# EAGLE design 2PCB-Part2 (EAGLE 9.6.2)
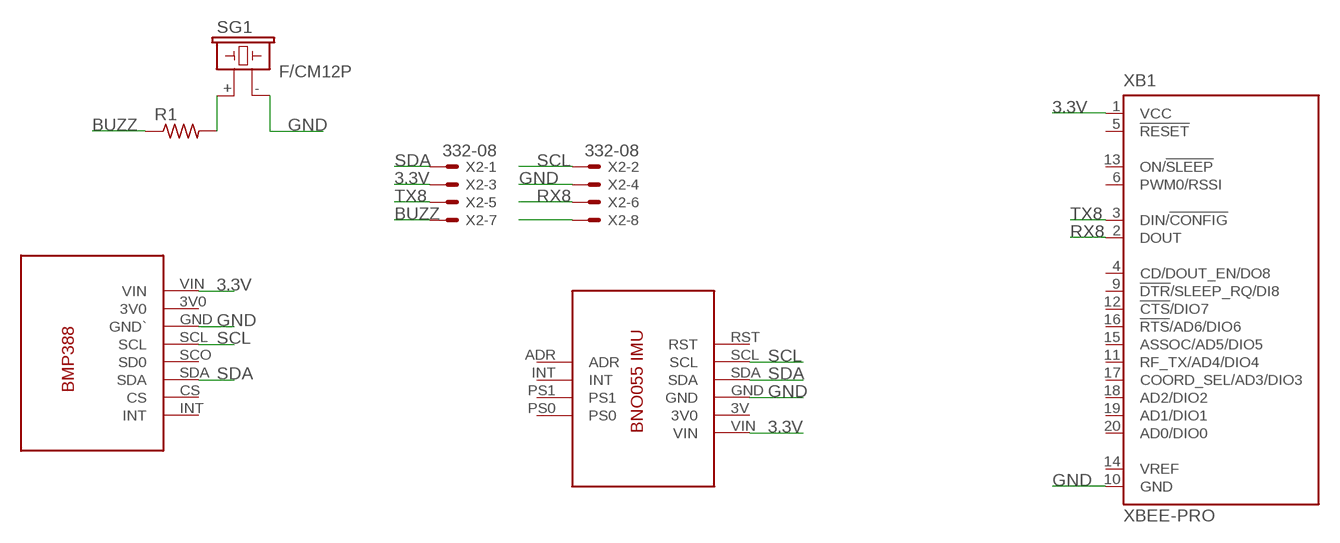
[diagram p0: schematic, sheet 1]

## Parts
R1  R-US_0207/10  [0207/10]
SG1  F/CM12P  [F/CM12P]
U$1  BNO055  [BNO055]
U$2  BMP388  [BMP388]
X2  332-08  [332-08]
XB1  XBEE-PRO  [XBEE-PRO]

## Nets
3.3V: U$1.VIN U$2.VIN X2.3 XB1.1(VCC)
BUZZ: R1.1 X2.7
GND: SG1.- U$1.GND U$2.GND(GND`) X2.4 XB1.10(GND)
N$4: R1.2 SG1.+
N$9: X2.8
RX8: X2.6 XB1.2(DOUT)
SCL: U$1.SCL U$2.SCL X2.2
SDA: U$1.SDA U$2.SDA X2.1
TX8: X2.5 XB1.3(DIN/!CONFIG)
Unconnected: U$1.3V(3V0) U$1.ADR U$1.INT U$1.PS0 U$1.PS1 U$1.RST U$2.3V0 U$2.CS U$2.INT U$2.SCO(SD0) XB1.4(CD/DOUT_EN/DO8) XB1.5(!RESET) XB1.6(PWM0/RSSI) XB1.9(!DTR!/SLEEP_RQ/DI8) XB1.11(RF_TX/AD4/DIO4) XB1.12(!CTS!/DIO7) XB1.13(ON/!SLEEP) XB1.14(VREF) XB1.15(ASSOC/AD5/DIO5) XB1.16(!RTS!/AD6/DIO6) XB1.17(COORD_SEL/AD3/DIO3) XB1.18(AD2/DIO2) XB1.19(AD1/DIO1) XB1.20(AD0/DIO0)

## Library data of the parts
R1 = rcl:R-US_: RESISTOR, American symbol; SPICEPREFIX: R
SG1 = buzzer:F/CM12P: BUZZER Source: Buerklin; OC_FARNELL: unknown; OC_NEWARK: unknown
U$1 = Bno055:BNO055
U$2 = bmp388:BMP388
X2 = 6pinConnector:332-08: 8 Pin - 2mm Dual Row Source: www.mpe-connector.de / garry_shortform_2012.pdf
XB1 = maxstream:XBEE: XBee (TM) /XBee-PRO(TM) OEM RF Modules Source: MaxStream, Inc. xbee_productmanual.pdf; MPN: XBP24-AWI-001; OC_FARNELL: 1337916; OC_NEWARK: 42M2667

## Board
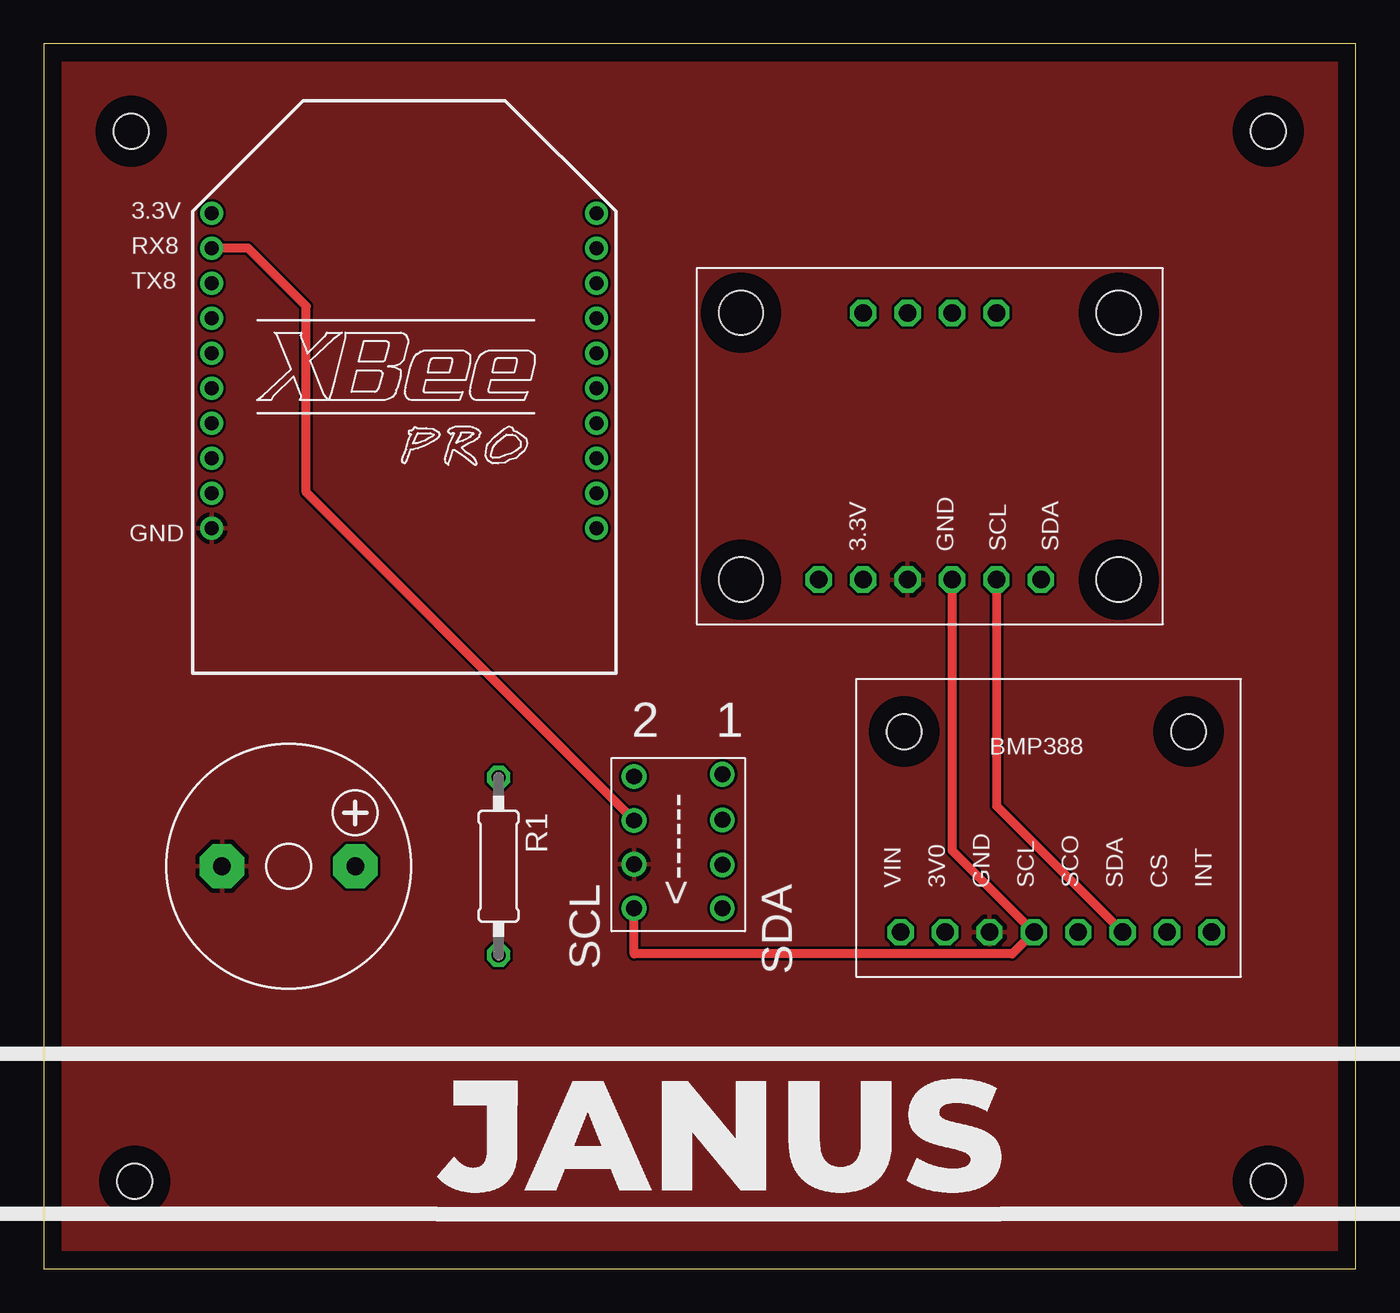
[diagram p1: board, top side]
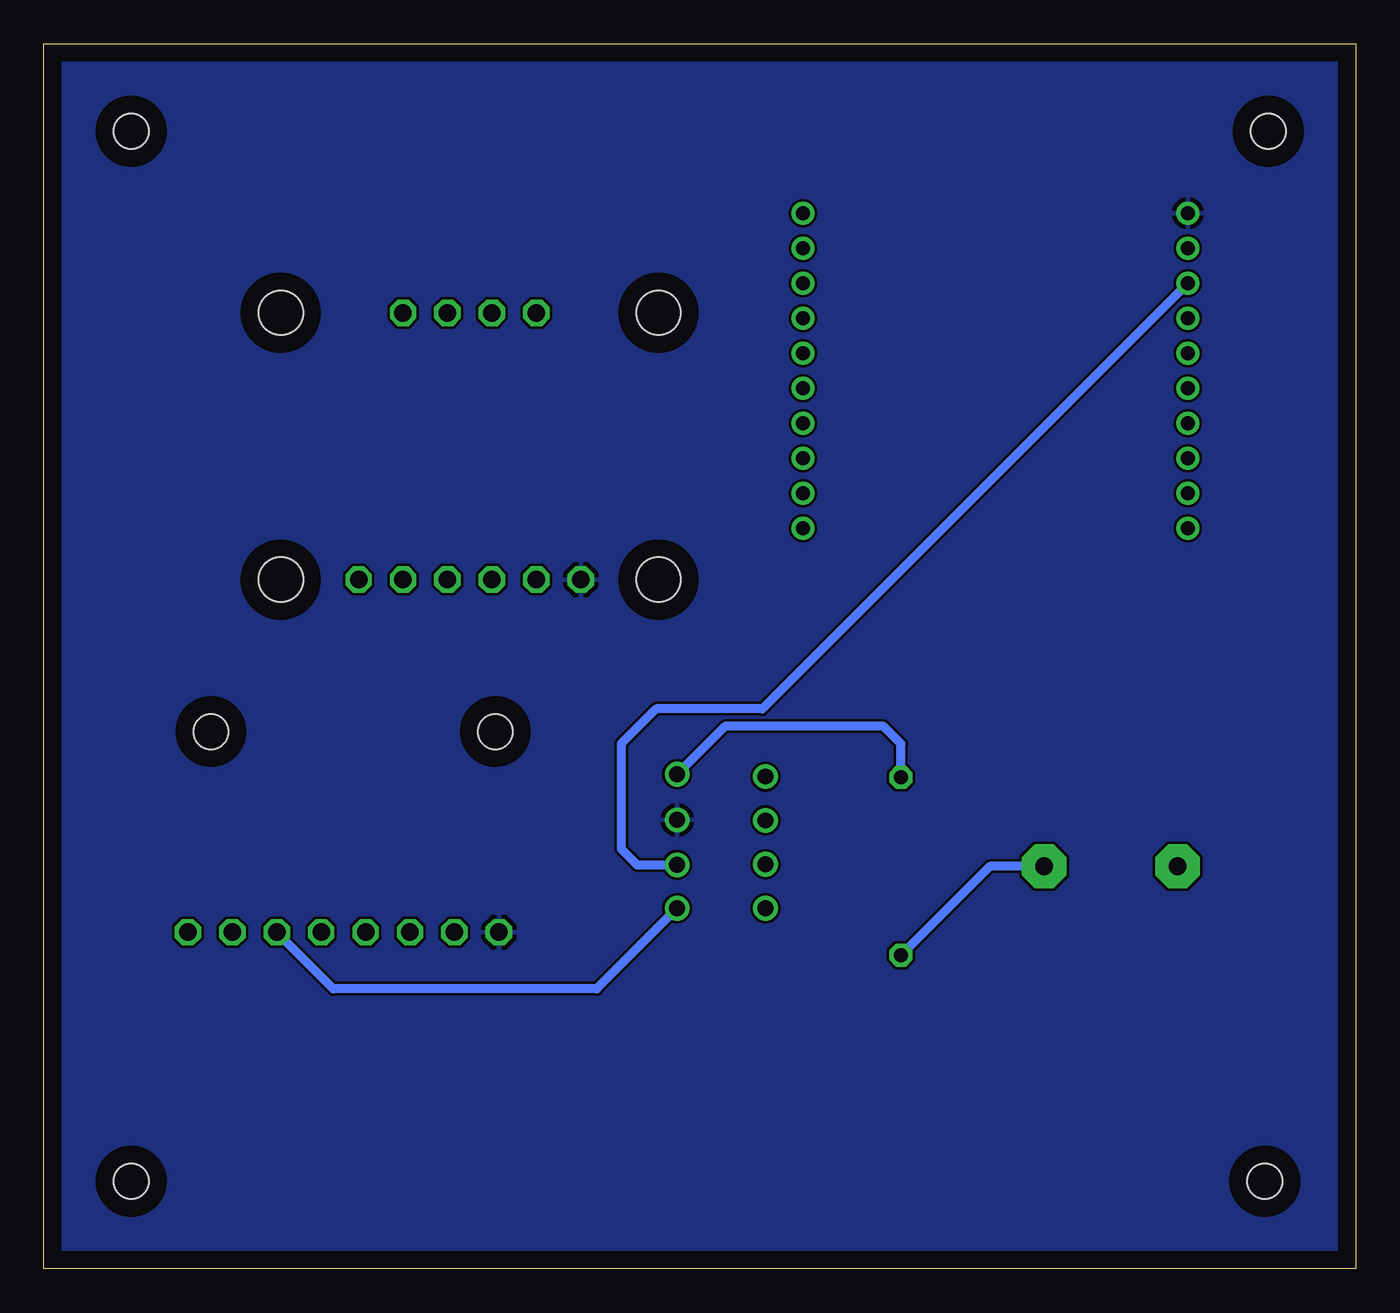
[diagram p2: board, bottom side, seen from below]

Size 75 x 70 mm. Coordinates in mm from the lower left corner, seen from the top.
Outline: 0,0 75,0 75,70 0,70 0,0
Copper layers (1*16): Top 0.035mm / dielectric 1.5mm / Bottom 0.035mm
Design rules "default": minimum track width 6mil, minimum drill 0.35mm, track to track 6mil, track to pad 6mil, pad to pad 6mil, via to via 6mil, smd to smd 6mil, copper to edge 40mil, drill to drill 6mil, minimum pad ring 10mil, minimum via ring 8mil, stop-mask expansion 4mil, vias tented up to drill 0mil, thermal gap 10mil
Holes 2 mm at 5,65 5.2,5 70,5 70,65

### Footprints (pad centres in the part's own frame; a part is rotated, then mirrored left to right if it is on the bottom)
0207/10 = drill 0.813 octagon: 1 -5.08,0; 2 5.08,0
F/CM12P = drill 1.016 pad 2.54 octagon: + 3.81,0; - -3.81,0
BNO055 = drill 1 octagon: 3V 9.525,2.54; ADR 12.065,17.78; GND 12.065,2.54; INT 9.525,17.78; PS0 14.605,17.78; PS1 17.145,17.78; RST 19.685,2.54; SCL 14.605,2.54; SDA 17.145,2.54; VIN 6.985,2.54 | hole 2.54: 2.54,17.78; 2.54,2.54; 24.13,2.54; 24.13,17.78
BMP388 = drill 1 octagon: 3V0 5.08,2.54; CS 17.78,2.54; GND 7.62,2.54; INT 20.32,2.54; SCL 10.16,2.54; SCO 12.7,2.54; SDA 15.24,2.54; VIN 2.54,2.54 | hole 2: 2.75,14; 19,14
332-08 = drill 0.9 pad 1.27: 1 -4.397,-3.794; 2 -4.397,1.254; 3 0.651,-3.794; 4 -1.889,1.254; 5 -1.921,-3.794; 6 0.619,1.254; 7 3.254,-3.794; 8 3.127,1.254
XBEE-PRO = drill 0.8 pad 1.27: 1 -11,9; 2 -11,7; 3 -11,5; 4 -11,3; 5 -11,1; 6 -11,-1; 7 -11,-3; 8 -11,-5; 9 -11,-7; 10 -11,-9; 11 11,-9; 12 11,-7; 13 11,-5; 14 11,-3; 15 11,-1; 16 11,1; 17 11,3; 18 11,5; 19 11,7; 20 11,9

### Placement (x,y rotation side)
R1  26,23 270 top
SG1  14,23 0 top
U$1  37.31,36.84 0 top
U$2  46.44,16.69 0 top
X2  35,25 90 top
XB1  20.6,51.32 0 top

### Tracks (layer width: path | path; a pad name or v marks a point on that pad's centre or on a via)
3.3V
  pour Bottom: -11,83 87,83 96,74 96,-8 -19,-8 -19,75
BUZZ
  Bottom 0.5: R1.1 26,30 27,31 36.05,31 X2.7
GND
  pour Top: -6,77 86,77 87,76 87,-3 86,-4 -7,-4 -10,-1 -10,73
N$4
  Bottom 0.5: SG1.+ 20.92,23 R1.2
RX8
  Top 0.5: X2.6 15,44.37 15,55 11.68,58.32 XB1.2
SCL
  Top 0.5: U$1.SCL 51.92,23.91 U$2.SCL 55.37,18 33.75,18 X2.2
  Bottom 0.5: 56.92,19.55 U$2.SCL
SDA
  Top 0.5: U$1.SDA 54.46,26.45 U$2.SDA
  Bottom 0.5: X2.1 43.4,16 58.45,16 U$2.SDA
TX8
  Bottom 0.5: XB1.3 33.92,32 40,32 42,30 42,24 41.08,23.08 X2.5

### Text on the board
tPlace: 3.3V | RX8 | TX8 | GND | 3.3V | GND | SCL | SDA | 2 | 1 | <------ | SCL | SDA